# Altium schematic sheet FIT_FPGA_POWER.SchDoc: FIT_PM12 board
size 420 x 297 mm; CheckedBy: G.Kasprowicz; Author: INR Moscow; CompanyName: WUT ISE; DrawnBy: M.Podgórski; Organization: WUT ISE; Address1: PW ISE; Address2: Nowowiejska 15/19 00-665 Warsaw; Address3: gkasprow@gmail.com; Revision: 2; SheetNumber: -; SheetTotal: -; ModifiedBy: -; CheckedDate: -; Title2: Title 2; DivGrp: WUT ISE; Designer: INR RAS; ModifiedDate: -; ProjectName: Sensor Box
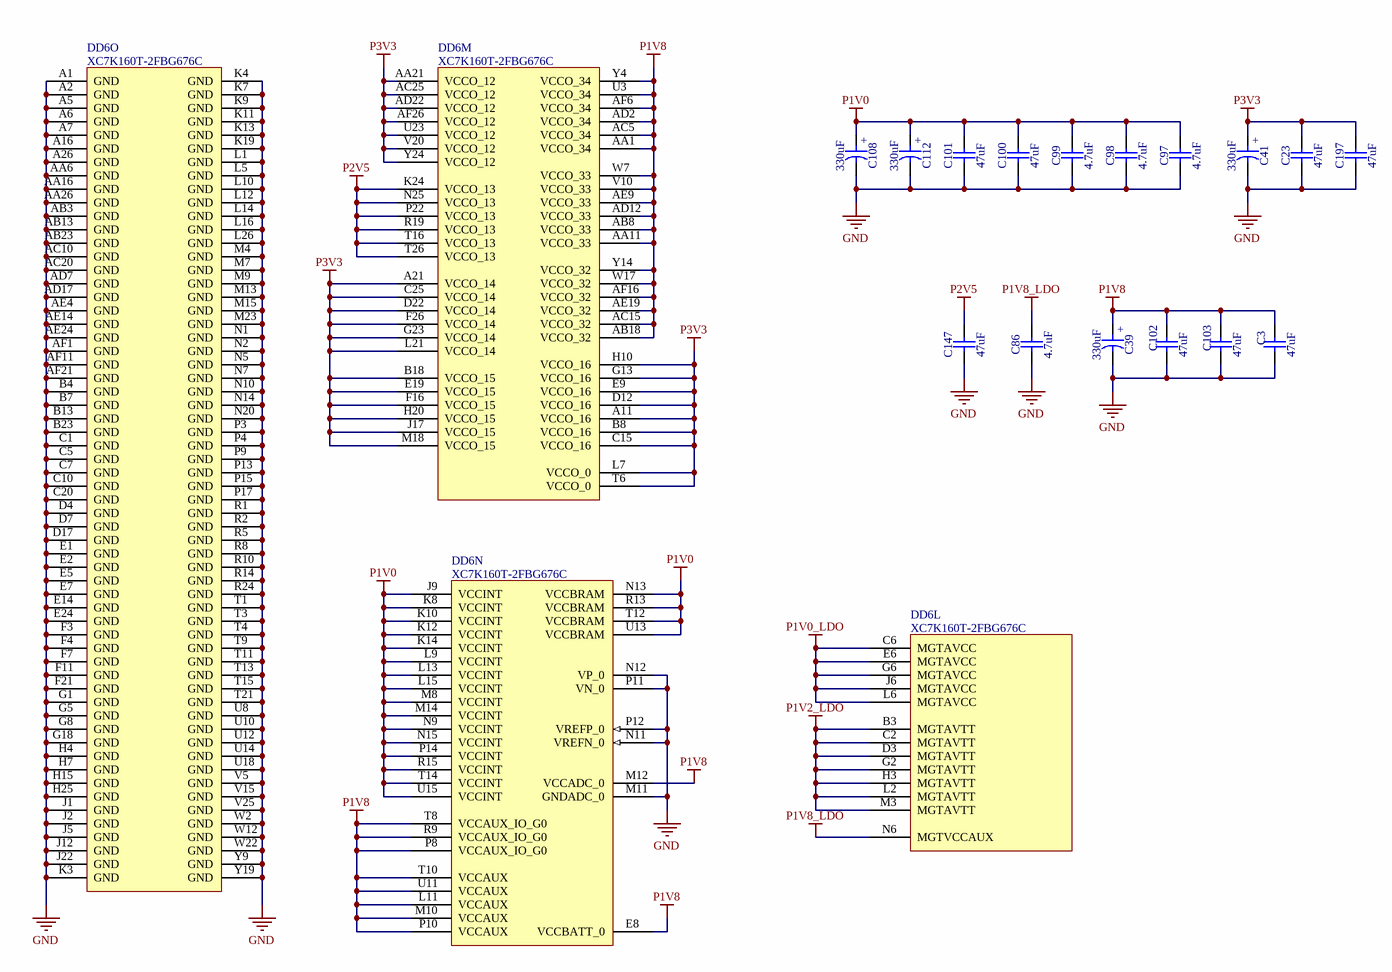
[diagram p0: FIT_FPGA_POWER.SchDoc]

## Parts
C3  47uF  [CAPC3225X270N]
C23  47uF  [CAPC3225X270N]
C39  330uF  [CAPMP7343X300N]
C41  330uF  [CAPMP7343X310N]
C86  4.7uF  [CAPC2012X145N]
C97  4.7uF  [CAPC2012X145N]
C98  4.7uF  [CAPC2012X145N]
C99  4.7uF  [CAPC2012X145N]
C100  47uF  [CAPC3225X270N]
C101  47uF  [CAPC3225X270N]
C102  47uF  [CAPC3225X270N]
C103  47uF  [CAPC3225X270N]
C108  330uF  [CAPMP7343X190N]
C112  330uF  [CAPMP7343X190N]
C147  47uF  [CAPC3225X270N]
C197  47uF  [CAPC3225X270N]
DD6  XC7K160T-2FBG676C  [BGA676C100P26X26_2700X2700X254]  (parts L,M,N,O of 15)

## Nets
GND: C3.1 C23.1 C39.2 C41.2 C86.1 C97.1 C98.1 C99.1 C100.1 C101.1 C102.1 C103.1 C108.2 C112.2 C147.1 C197.1 DD6.A1(GND) DD6.A2(GND) DD6.A5(GND) DD6.A6(GND) DD6.A7(GND) DD6.A16(GND) DD6.A26(GND) DD6.AA6(GND) DD6.AA16(GND) DD6.AA26(GND) DD6.AB3(GND) DD6.AB13(GND) DD6.AB23(GND) DD6.AC10(GND) DD6.AC20(GND) DD6.AD7(GND) DD6.AD17(GND) DD6.AE4(GND) DD6.AE14(GND) DD6.AE24(GND) DD6.AF1(GND) DD6.AF11(GND) DD6.AF21(GND) DD6.B4(GND) DD6.B7(GND) DD6.B13(GND) DD6.B23(GND) DD6.C1(GND) DD6.C5(GND) DD6.C7(GND) DD6.C10(GND) DD6.C20(GND) DD6.D4(GND) DD6.D7(GND) DD6.D17(GND) DD6.E1(GND) DD6.E2(GND) DD6.E5(GND) DD6.E7(GND) DD6.E14(GND) DD6.E24(GND) DD6.F3(GND) DD6.F4(GND) DD6.F7(GND) DD6.F11(GND) DD6.F21(GND) DD6.G1(GND) DD6.G5(GND) DD6.G8(GND) DD6.G18(GND) DD6.H4(GND) DD6.H7(GND) DD6.H15(GND) DD6.H25(GND) DD6.J1(GND) DD6.J2(GND) DD6.J5(GND) DD6.J12(GND) DD6.J22(GND) DD6.K3(GND) DD6.K4(GND) DD6.K7(GND) DD6.K9(GND) DD6.K11(GND) DD6.K13(GND) DD6.K19(GND) DD6.L1(GND) DD6.L5(GND) DD6.L10(GND) DD6.L12(GND) DD6.L14(GND) DD6.L16(GND) DD6.L26(GND) DD6.M4(GND) DD6.M7(GND) DD6.M9(GND) DD6.M11(GNDADC_0) DD6.M13(GND) DD6.M15(GND) DD6.M23(GND) DD6.N1(GND) DD6.N2(GND) DD6.N5(GND) DD6.N7(GND) DD6.N10(GND) DD6.N11(VREFN_0) DD6.N12(VP_0) DD6.N14(GND) DD6.N20(GND) DD6.P3(GND) DD6.P4(GND) DD6.P9(GND) DD6.P11(VN_0) DD6.P12(VREFP_0) DD6.P13(GND) DD6.P15(GND) DD6.P17(GND) DD6.R1(GND) DD6.R2(GND) DD6.R5(GND) DD6.R8(GND) DD6.R10(GND) DD6.R14(GND) DD6.R24(GND) DD6.T1(GND) DD6.T3(GND) DD6.T4(GND) DD6.T9(GND) DD6.T11(GND) DD6.T13(GND) DD6.T15(GND) DD6.T21(GND) DD6.U8(GND) DD6.U10(GND) DD6.U12(GND) DD6.U14(GND) DD6.U18(GND) DD6.V5(GND) DD6.V15(GND) DD6.V25(GND) DD6.W2(GND) DD6.W12(GND) DD6.W22(GND) DD6.Y9(GND) DD6.Y19(GND)
P1V0: C97.2 C98.2 C99.2 C100.2 C101.2 C108.1 C112.1 DD6.J9(VCCINT) DD6.K8(VCCINT) DD6.K10(VCCINT) DD6.K12(VCCINT) DD6.K14(VCCINT) DD6.L9(VCCINT) DD6.L13(VCCINT) DD6.L15(VCCINT) DD6.M8(VCCINT) DD6.M14(VCCINT) DD6.N9(VCCINT) DD6.N13(VCCBRAM) DD6.N15(VCCINT) DD6.P14(VCCINT) DD6.R13(VCCBRAM) DD6.R15(VCCINT) DD6.T12(VCCBRAM) DD6.T14(VCCINT) DD6.U13(VCCBRAM) DD6.U15(VCCINT)
P1V0_LDO: DD6.C6(MGTAVCC) DD6.E6(MGTAVCC) DD6.G6(MGTAVCC) DD6.J6(MGTAVCC) DD6.L6(MGTAVCC)
P1V2_LDO: DD6.B3(MGTAVTT) DD6.C2(MGTAVTT) DD6.D3(MGTAVTT) DD6.G2(MGTAVTT) DD6.H3(MGTAVTT) DD6.L2(MGTAVTT) DD6.M3(MGTAVTT)
P1V8: C3.2 C39.1 C102.2 C103.2 DD6.AA1(VCCO_34) DD6.AA11(VCCO_33) DD6.AB8(VCCO_33) DD6.AB18(VCCO_32) DD6.AC5(VCCO_34) DD6.AC15(VCCO_32) DD6.AD2(VCCO_34) DD6.AD12(VCCO_33) DD6.AE9(VCCO_33) DD6.AE19(VCCO_32) DD6.AF6(VCCO_34) DD6.AF16(VCCO_32) DD6.E8(VCCBATT_0) DD6.L11(VCCAUX) DD6.M10(VCCAUX) DD6.M12(VCCADC_0) DD6.P8(VCCAUX_IO_G0) DD6.P10(VCCAUX) DD6.R9(VCCAUX_IO_G0) DD6.T8(VCCAUX_IO_G0) DD6.T10(VCCAUX) DD6.U3(VCCO_34) DD6.U11(VCCAUX) DD6.V10(VCCO_33) DD6.W7(VCCO_33) DD6.W17(VCCO_32) DD6.Y4(VCCO_34) DD6.Y14(VCCO_32)
P1V8_LDO: C86.2 DD6.N6(MGTVCCAUX)
P2V5: C147.2 DD6.K24(VCCO_13) DD6.N25(VCCO_13) DD6.P22(VCCO_13) DD6.R19(VCCO_13) DD6.T16(VCCO_13) DD6.T26(VCCO_13)
P3V3: C23.2 C41.1 C197.2 DD6.A11(VCCO_16) DD6.A21(VCCO_14) DD6.AA21(VCCO_12) DD6.AC25(VCCO_12) DD6.AD22(VCCO_12) DD6.AF26(VCCO_12) DD6.B8(VCCO_16) DD6.B18(VCCO_15) DD6.C15(VCCO_16) DD6.C25(VCCO_14) DD6.D12(VCCO_16) DD6.D22(VCCO_14) DD6.E9(VCCO_16) DD6.E19(VCCO_15) DD6.F16(VCCO_15) DD6.F26(VCCO_14) DD6.G13(VCCO_16) DD6.G23(VCCO_14) DD6.H10(VCCO_16) DD6.H20(VCCO_15) DD6.J17(VCCO_15) DD6.L7(VCCO_0) DD6.L21(VCCO_14) DD6.M18(VCCO_15) DD6.T6(VCCO_0) DD6.U23(VCCO_12) DD6.V20(VCCO_12) DD6.Y24(VCCO_12)

## Notes on the sheet
- Project/Equipment
- Document
- Designer
- Drawn by
- Check.by
- Copyright WUT ISE 2024.
  This documentation describes Open Hardware and is licensed under the CERN OHL v.2. You may redistribute and modify this documentation under the terms of the CERN OHL v.2. (http://ohwr.org/CERNOHL). This documentation is distributed WITHOUT ANY EXPRESS OR IMPLIED WARRANTY, INCLUDING OF MERCHANTABILITY, SATISFACTORY QUALITY AND FITNESS FOR A PARTICULAR PURPOSE. Please see the CERN OHL v.2 for applicable conditions.
- Contact
- File
- Last Mod.
- Print Date
- Sheet
- Size
- A3
- of
- Rev
- (in symbol CTE7343-19_330UF_2.5V_20%_LESR0009_KEMET_T520) +
- (in symbol CTE7343-30_330UF_4V_20%_PANASONIC_TPF) +
- (in symbol CTE7343-31_330UF_6.3V_20%_LESR0015_KEMET_T520) +

## Library data of the parts
C3 C23 C100-C103 C147 C197 = CC1210_47UF_16V_20%_X5R: Non-polarised capacitor; Part Description: SMD Multilayer Chip Ceramic Capacitor; Manufacturer: GENERIC; Manufacturer1 Part Number: EMK325BJ476MM-T; Voltage: 16V; TC: X5R; Tolerance: ±20%; Part Number: CC1210_47UF_16V_20%_X5R; Component Kind: Standard; Component Type: Standard; Pin Count: 2; Value: 47uF; Status: None; Manufacturer Part Number: CC1210_47UF_16V_20%_X5R; Case: 1210; Mounted: Yes; Socket: No; SMD: Yes; Sense: No; Manufacturer1 Example: TAIYO YUDEN; Manufacturer1 ComponentHeight: 2.7mm; HelpURL: \\cern.ch\dfs\Applications\Altium\Datasheets\CC1210_X5R_TAIYO-YUDEN_HIGH-VALUE.pdf; Author: CERN DEM MR; CreateDate: 03.02.2016; LatestRevisionDate: 03.02.2016
C39 = CTE7343-30_330UF_4V_20%_PANASONIC_TPF: Polarised capacitor; Part Description: ESR 0R009 Tantalum Chip Capacitor; Manufacturer Part Number: 4TPF330M9L; Voltage: 4V; Tolerance: ±20%; Part Number: CTE7343-30_330UF_4V_20%_PANASONIC_TPF; Component Kind: Standard; Component Type: Standard; Pin Count: 2; Value: 330uF; Status: None; Manufacturer: PANASONIC; Mounted: Yes; Socket: No; SMD: Yes; Sense: No; ComponentHeight: 3mm; HelpURL: \\cern.ch\dfs\Applications\Altium\Datasheets\CTE_PANASONIC_TPF.pdf; Author: CERN DEM HF; CreateDate: 30.05.2024; LatestRevisionDate: 30.05.2024
C41 = CTE7343-31_330UF_6.3V_20%_LESR0015_KEMET_T520: Polarised capacitor; Part Description: Low ESR 0R015 Tantalum Chip Capacitor; Manufacturer: KEMET; Manufacturer Part Number: T520D337M006ATE015; Voltage: 6.3V; Tolerance: ±20%; Part Number: CTE7343-31_330UF_6.3V_20%_LESR0015_KEMET_T520; Component Kind: Standard; Component Type: Standard; Pin Count: 2; Value: 330uF; Status: None; Case: D; Mounted: Yes; Socket: No; SMD: Yes; Sense: No; ComponentHeight: 3.1mm; HelpURL: \\cern.ch\dfs\Applications\Altium\Datasheets\CTE-LESR_KEMET_T520.pdf; Author: CERN DEM JLC; CreateDate: 11.01.2012; LatestRevisionDate: 11.01.2012
C86 C97-C99 = CC0805_4.7UF_50V_10%_X7R: Non-polarised capacitor; Part Description: SMD Multilayer Chip Ceramic Capacitor; Manufacturer: GENERIC; Manufacturer1 Part Number: C2012X7R1H475K125; Voltage: 50V; TC: X7R; Tolerance: ±10%; Part Number: CC0805_4.7UF_50V_10%_X7R; Component Kind: Standard; Component Type: Standard; Pin Count: 2; Value: 4.7uF; Status: Preferred; Manufacturer Part Number: CC0805_4.7UF_50V_10%_X7R; Case: 0805; Mounted: Yes; Socket: No; SMD: Yes; Sense: No; Manufacturer1 Example: TDK; Manufacturer1 ComponentHeight: 1.45mm; HelpURL: \\cern.ch\dfs\Applications\Altium\Datasheets\CC0805_X7R_TDK_C.pdf; Author: CERN DEM JMW; CreateDate: 30.07.2021; LatestRevisionDate: 30.07.2021
C108 C112 = CTE7343-19_330UF_2.5V_20%_LESR0009_KEMET_T520: Polarised capacitor; Part Description: Low ESR 0R009 Tantalum Chip Capacitor; Manufacturer: KEMET; Manufacturer Part Number: T520V337M2R5ATE009; Voltage: 2.5V; Tolerance: ±20%; Part Number: CTE7343-19_330UF_2.5V_20%_LESR0009_KEMET_T520; Component Kind: Standard; Component Type: Standard; Pin Count: 2; Value: 330uF; Status: None; Case: V; Mounted: Yes; Socket: No; SMD: Yes; Sense: No; ComponentHeight: 1.9mm; HelpURL: \\cern.ch\dfs\Applications\Altium\Datasheets\CTE-LESR_KEMET_T520.pdf; Author: CERN DEM HF; CreateDate: 30.05.2024; LatestRevisionDate: 30.05.2024
DD6 = XC7K160T-2FBG676C: KINTEX-7, FPGA, 676-Ball BGA, Pb-Free; Part Description: KINTEX-7 FPGA, 162240 Logic Cells, 400 User I/O, 8 GTXs, 676-Ball BGA, Speed Grade 2, Commercial Grade, Pb-Free; Manufacturer: XILINX; PressFit: No; Bonding: No; Part Number: XC7K160T-2FBG676C; Component Kind: Standard; Component Type: Standard; Device: XC7K160T-2FBG676C; PackageDescription: BGA, 1.00mm Pitch, Square; 676 Pin, 26 Columns X 26 Rows, Body 27.0mm X 27.0mm X 2.54mm H, IPC Medium Density; Manufacturer Part Number: XC7K160T-2FBG676C; Pin Count: 676; Case: BGA676; Mounted: Yes; Socket: No; SMD: Yes; Sense: No; ComponentHeight: 2.54mm; HelpURL: \\cern.ch\dfs\Applications\Altium\Datasheets\XC7K160T-xFBG676C.pdf; ComponentLink1URL: \\cern.ch\dfs\Applications\Altium\Datasheets\XC7K160T-xFBG676C_Package-Pinout.pdf; ComponentLink1Description: Package/Pinout; Author: CERN DEM BC; CreateDate: 06.02.2020; LatestRevisionDate: 06.02.2020